# Altium schematic sheet mcu1_secondary.SchDoc: foxBMS BMS-Master
size A3; DocumentNumber: 11; SheetNumber: 11; SheetTotal: 24; Author: Fraunhofer IISB foxBMS Team; REL-DATE: 2017-05-16; VERSION: 1.0.2; SheetDescription: MCU1 (Secondary); ClassName: ISO_MCU_SEC
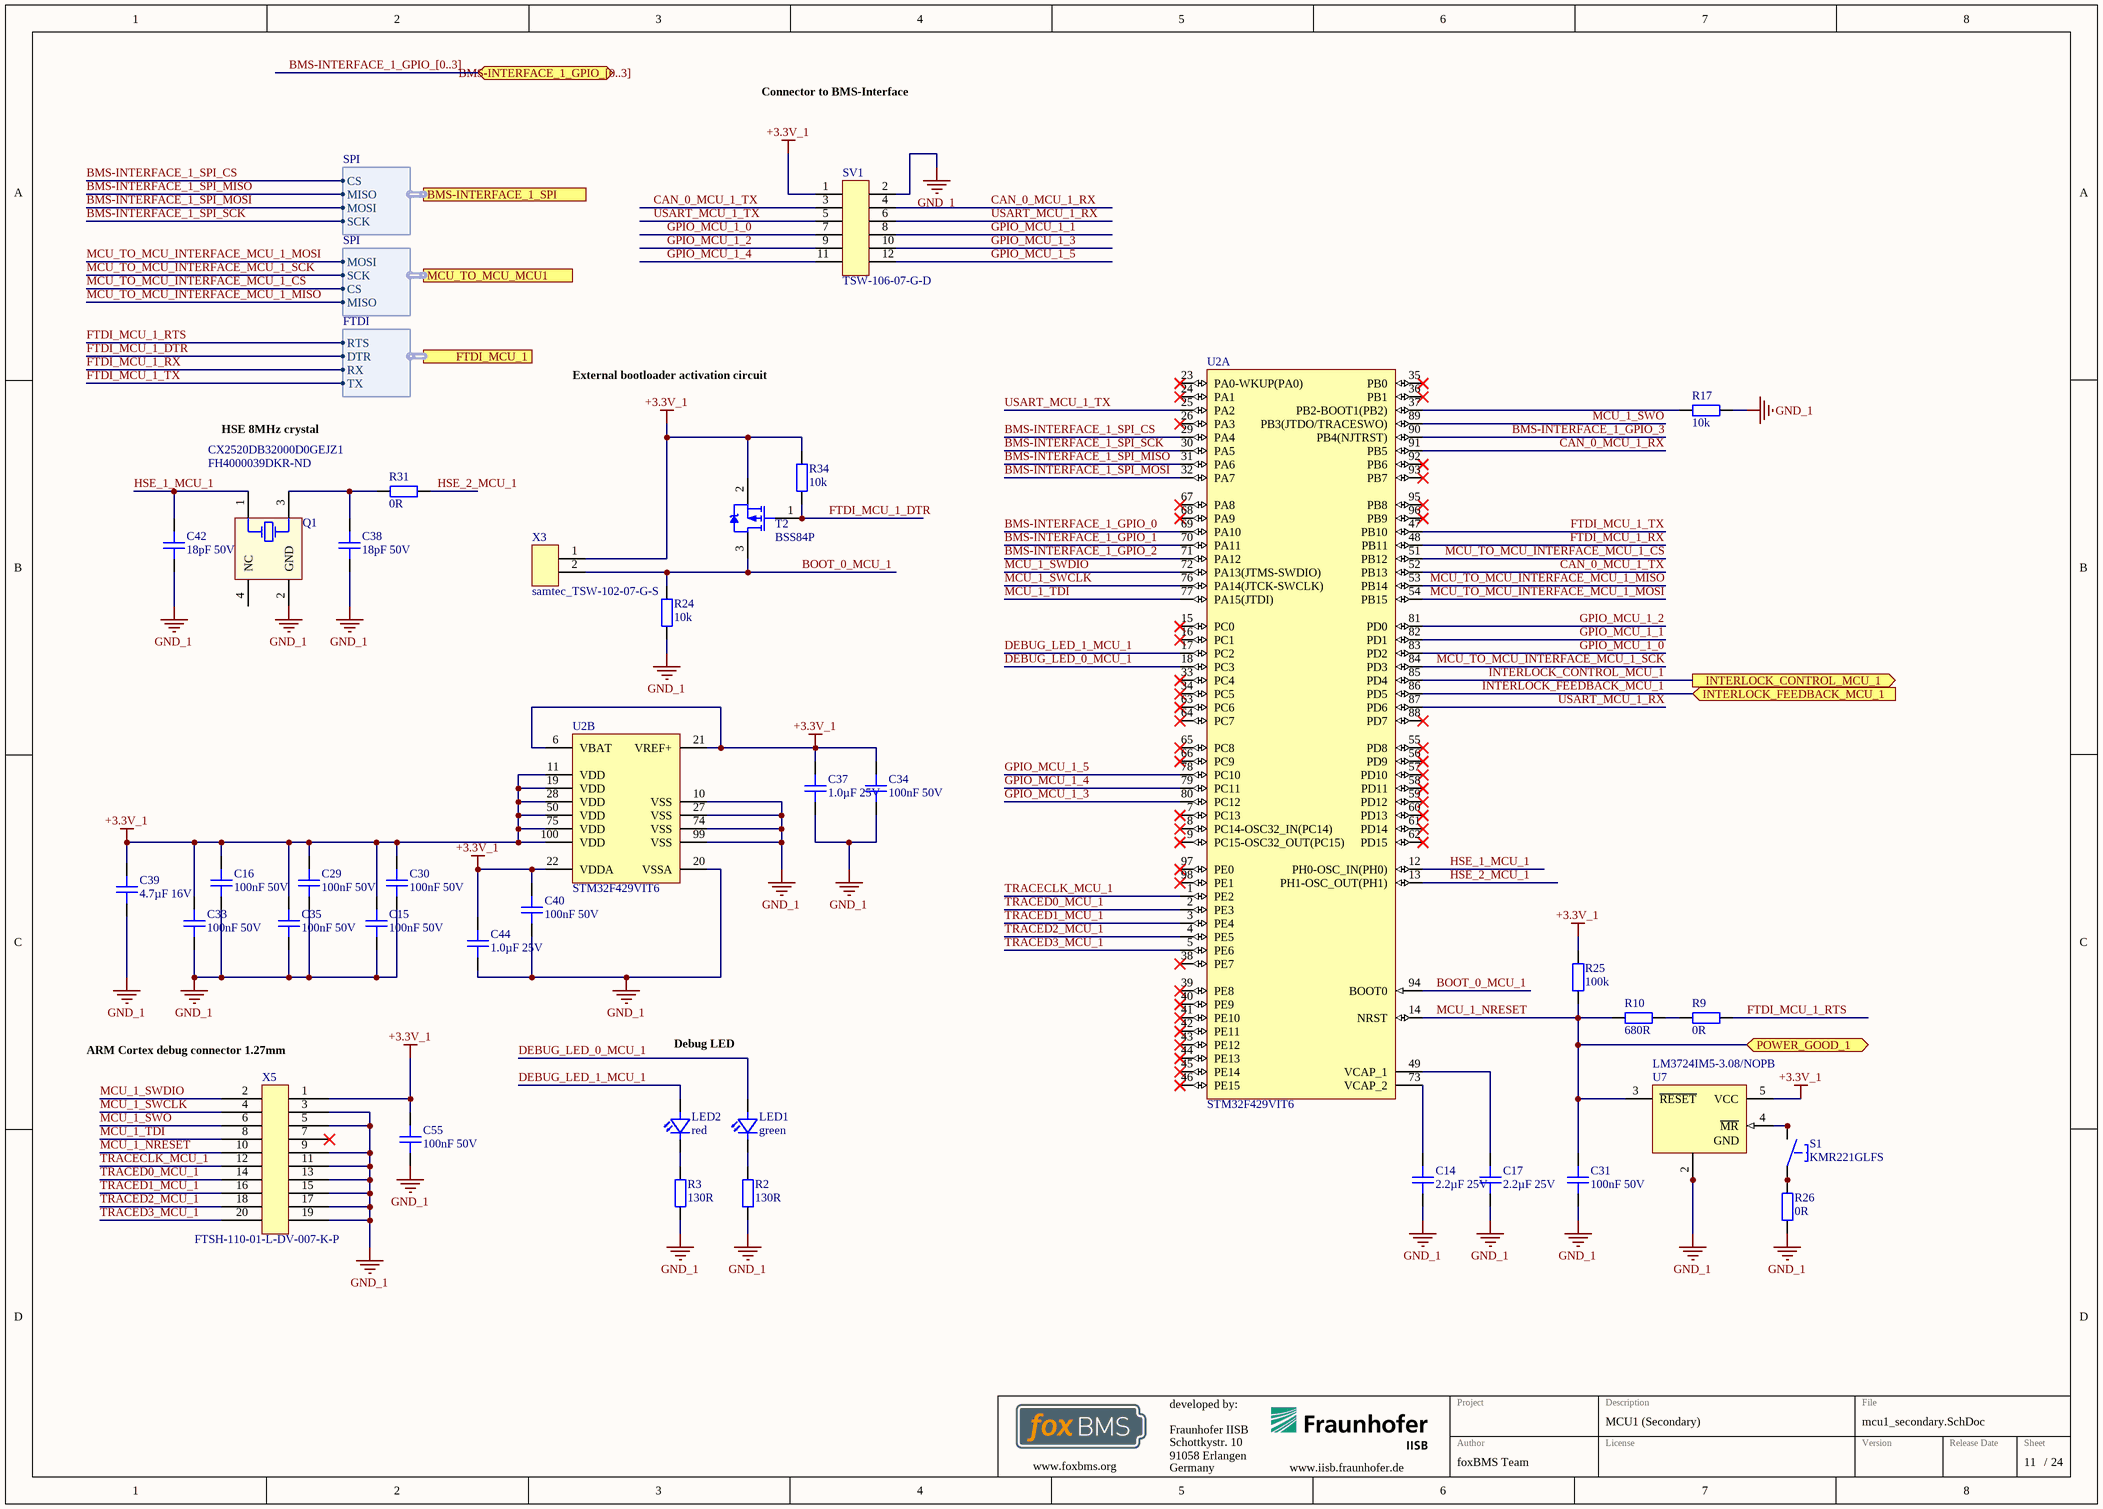
[diagram p0: mcu1_secondary.SchDoc]

## Parts
C14  2.2µF 25V  [0805C]
C15  100nF 50V  [0402C]
C16  100nF 50V  [0402C]
C17  2.2µF 25V  [0805C]
C29  100nF 50V  [0402C]
C30  100nF 50V  [0402C]
C31  100nF 50V  [0603C]
C33  100nF 50V  [0402C]
C34  100nF 50V  [0402C]
C35  100nF 50V  [0402C]
C37  1.0µF 25V  [0603C]
C38  18pF 50V  [0402C]
C39  4.7µF 16V  [0805C]
C40  100nF 50V  [0402C]
C42  18pF 50V  [0402C]
C44  1.0µF 25V  [0603C]
C55  100nF 50V  [0603C]
LED1  green  [LEDC1608X07N]
LED2  red  [LEDC1608X07N]
Q1  CX2520DB32000D0GEJZ1  Supplier Part Number 1: FH4000039DKR-ND  [AVX-CX2520DB32000D0GEJZ1-4_V]
R2  130R  [0603R]
R3  130R  [0603R]
R9  0R  [0603R]
R10  680R  [0603R]
R17  10k  [0603R]
R24  10k  [0603R]
R25  100k  [0603R]
R26  0R  [0603R]
R31  0R  [0402R]
R34  10k  [0603R]
S1  KMR221GLFS  [KMR2_Series]
SV1  TSW-106-07-G-D  [Pinheader_2.54_2x6]
T2  BSS84P  [INF-PG-SOT23_N]
U2  STM32F429VIT6  [STM-LQFP100_N]  (parts A,B of 2)
U7  LM3724IM5-3.08/NOPB  [MF05A_N]
X3  samtec_TSW-102-07-G-S  [Pinheader_2.54_2]
X5  FTSH-110-01-L-DV-007-K-P  [CORTEX_DEBUG_20_PIN]

## Ports
BMS-INTERFACE_1_GPIO_[0..3] (bidir), BMS-INTERFACE_1_SPI (harness SPI), FTDI_MCU_1 (harness FTDI), INTERLOCK_CONTROL_MCU_1 (out), INTERLOCK_FEEDBACK_MCU_1 (in), MCU_TO_MCU_MCU1 (harness SPI), POWER_GOOD_1 (bidir)

## Harnesses
SPI: CS, MISO, MOSI, SCK
FTDI: RTS, DTR, RX, TX

## Nets
+3.3V_1: C15.1 C16.1 C29.1 C30.1 C33.1 C34.1 C35.1 C37.1 C39.1 C40.1 C44.1 C55.1 R25.2 R34.2 SV1.1 T2.2(SOURCE) U2.6(VBAT) U2.11(VDD) U2.19(VDD) U2.21(VREF+) U2.22(VDDA) U2.28(VDD) U2.50(VDD) U2.75(VDD) U2.100(VDD) U7.5(VCC) X3.1 X5.1
GND_1: C14.2 C15.2 C16.2 C17.2 C29.2 C30.2 C31.2 C33.2 C34.2 C35.2 C37.2 C38.2 C39.2 C40.2 C42.1 C44.2 C55.2 Q1.2(GND) R2.1 R3.1 R17.1 R24.1 R26.1 SV1.2 U2.10(VSS) U2.20(VSSA) U2.27(VSS) U2.74(VSS) U2.99(VSS) U7.1(GND) U7.2(GND) X5.3 X5.5 X5.9 X5.11 X5.13 X5.15 X5.17 X5.19
BMS-INTERFACE_1_GPIO_0: U2.69(PA10)
BMS-INTERFACE_1_GPIO_1: U2.70(PA11)
BMS-INTERFACE_1_GPIO_2: U2.71(PA12)
BMS-INTERFACE_1_GPIO_3: U2.90(PB4(NJTRST))
BMS-INTERFACE_1_SPI_CS: U2.29(PA4) ; port BMS-INTERFACE_1_SPI.CS
BMS-INTERFACE_1_SPI_MISO: U2.31(PA6) ; port BMS-INTERFACE_1_SPI.MISO
BMS-INTERFACE_1_SPI_MOSI: U2.32(PA7) ; port BMS-INTERFACE_1_SPI.MOSI
BMS-INTERFACE_1_SPI_SCK: U2.30(PA5) ; port BMS-INTERFACE_1_SPI.SCK
BOOT_0_MCU_1: R24.2 T2.3(DRAIN) U2.94(BOOT0) X3.2
CAN_0_MCU_1_RX: SV1.4 U2.91(PB5)
CAN_0_MCU_1_TX: SV1.3 U2.52(PB13)
DEBUG_LED_0_MCU_1: LED1.2(A) U2.18(PC3)
DEBUG_LED_1_MCU_1: LED2.2(A) U2.17(PC2)
FTDI_MCU_1_DTR: R34.1 T2.1(GATE) ; port FTDI_MCU_1.DTR
FTDI_MCU_1_RTS: R9.2 ; port FTDI_MCU_1.RTS
FTDI_MCU_1_RX: U2.48(PB11) ; port FTDI_MCU_1.RX
FTDI_MCU_1_TX: U2.47(PB10) ; port FTDI_MCU_1.TX
GPIO_MCU_1_0: SV1.7 U2.83(PD2)
GPIO_MCU_1_1: SV1.8 U2.82(PD1)
GPIO_MCU_1_2: SV1.9 U2.81(PD0)
GPIO_MCU_1_3: SV1.10 U2.80(PC12)
GPIO_MCU_1_4: SV1.11 U2.79(PC11)
GPIO_MCU_1_5: SV1.12 U2.78(PC10)
HSE_1_MCU_1: C42.2 Q1.1(HOT) U2.12(PH0-OSC_IN(PH0))
HSE_2_MCU_1: R31.1 U2.13(PH1-OSC_OUT(PH1))
INTERLOCK_CONTROL_MCU_1: U2.85(PD4) ; port INTERLOCK_CONTROL_MCU_1
INTERLOCK_FEEDBACK_MCU_1: U2.86(PD5) ; port INTERLOCK_FEEDBACK_MCU_1
MCU_1_NRESET: C31.1 R10.1 R25.1 U2.14(NRST) U7.3(~{RESET}) X5.10 ; port POWER_GOOD_1
MCU_1_SWCLK: U2.76(PA14(JTCK-SWCLK)) X5.4
MCU_1_SWDIO: U2.72(PA13(JTMS-SWDIO)) X5.2
MCU_1_SWO: U2.89(PB3(JTDO/TRACESWO)) X5.6
MCU_1_TDI: U2.77(PA15(JTDI)) X5.8
MCU_TO_MCU_INTERFACE_MCU_1_CS: U2.51(PB12) ; port MCU_TO_MCU_MCU1.CS
MCU_TO_MCU_INTERFACE_MCU_1_MISO: U2.53(PB14) ; port MCU_TO_MCU_MCU1.MISO
MCU_TO_MCU_INTERFACE_MCU_1_MOSI: U2.54(PB15) ; port MCU_TO_MCU_MCU1.MOSI
MCU_TO_MCU_INTERFACE_MCU_1_SCK: U2.84(PD3) ; port MCU_TO_MCU_MCU1.SCK
TRACECLK_MCU_1: U2.1(PE2) X5.12
TRACED0_MCU_1: U2.2(PE3) X5.14
TRACED1_MCU_1: U2.3(PE4) X5.16
TRACED2_MCU_1: U2.4(PE5) X5.18
TRACED3_MCU_1: U2.5(PE6) X5.20
USART_MCU_1_RX: SV1.6 U2.87(PD6)
USART_MCU_1_TX: SV1.5 U2.25(PA2)
NetC14_1: C14.1 U2.73(VCAP_2)
NetC17_1: C17.1 U2.49(VCAP_1)
NetC38_1: C38.1 Q1.3(HOT) R31.2
NetLED1_1: LED1.1(C) R2.2
NetLED2_1: LED2.1(C) R3.2
NetR9_1: R9.1 R10.2
NetR17_2: R17.2 U2.37(PB2-BOOT1(PB2))
NetR26_2: R26.2 S1.1 S1.2
NetS1_3: S1.3 S1.4 U7.4(~{MR})

Not connected (* = marked no-connect by the designer): Q1 4(NC); U2 7(PC13)* 8(PC14-OSC32_IN(PC14))* 9(PC15-OSC32_OUT(PC15))* 15(PC0)* 16(PC1)* 23(PA0-WKUP(PA0))* 24(PA1)* 26(PA3)* 33(PC4)* 34(PC5)* 35(PB0)* 36(PB1)* 38(PE7)* 39(PE8)* 40(PE9)* 41(PE10)* 42(PE11)* 43(PE12)* 44(PE13)* 45(PE14)* 46(PE15)* 55(PD8)* 56(PD9)* 57(PD10)* 58(PD11)* 59(PD12)* 60(PD13)* 61(PD14)* 62(PD15)* 63(PC6)* 64(PC7)* 65(PC8)* 66(PC9)* 67(PA8)* 68(PA9)* 88(PD7)* 92(PB6)* 93(PB7)* 95(PB8)* 96(PB9)* 97(PE0)* 98(PE1)*; X5 7*

## Buses and harness runs
bus BMS-INTERFACE_1_GPIO_[0..3] = port BMS-INTERFACE_1_GPIO_[0..3]

## Notes on the sheet
- Connector to BMS-Interface
- External bootloader activation circuit
- HSE 8MHz crystal
- (near X5) ARM Cortex debug connector 1.27mm
- Debug LED
- Fraunhofer IISB
- Schottkystr. 10
- developed by:
- 91058 Erlangen
- Germany
- Author
- Project
- License
- Description
- File
- Version
- Release Date
- Sheet
- www.foxbms.org
- www.iisb.fraunhofer.de
- foxBMS Team
- /

## Library data of the parts
C14 C17 = gen_C_ceramic_2u2_50V_X7R_0805: Ceramic, 2.2µF, ±10%, 25V, X7R, –55 to 125°C, 0805 (2012),RoHS, Automotive; Part Number: GCJ21BR71E225KA01; Manufacturer: Murata; Capacitance: 2u2; Case EIA: 0805; Case Metric: 2012; Automotive Qualified: True; PnP Package: C_0805_10; PnP Value: 2.2µF/25V/X7R; Rated Voltage: 25V; Dielectric: X7R; Height - Seated (Max): 1.25mm; Mounting Type: SurfaceMount,MLCC; Operating Temperature: –55 to 125°C; Series: GCJ; Tolerance: ±10%; Manufacturer_Part_Number: GCJ21BR71E225KA01
C15 C16 C29 C30 C33-C35 = gen_C_ceramic_100n_50V_X7R_0402: Ceramic, 100nF, ±10%, 50V, X7R, –55 to 125°C, 0402 (1005),RoHS, Automotive; Part Number: GCM155R71H104KE02; Manufacturer: Murata; Capacitance: 100n; Case EIA: 0402; Case Metric: 1005; PnP Package: C_0402_10; PnP Value: 100nF/50V/X7R; Automotive Qualified: True; PnP equipped: x; Rated Voltage: 50V; Dielectric: X7R; Supplier 1: Digi-Key; Supplier Part Number 1: 490-10672-1-ND; Height - Seated (Max): 0.5mm; Mounting Type: SurfaceMount,MLCC; Operating Temperature: –55 to 125°C; Series: GCM; Tolerance: ±10%; Manufacturer_Part_Number: GCM155R71H104KE02
C31 C55 = gen_C_ceramic_100n_50V_X7R_0603: Ceramic, 100nF, ±10%, 50V, X7R, –55 to 125°C, 0603 (1608),RoHS, Automotive; Part Number: GCJ188R71H104KA12; Manufacturer: Murata; Capacitance: 100n; Case EIA: 0603; Case Metric: 1608; PnP Package: C_0603_10; PnP Value: 100nF/50V/X7R; PnP equipped: x; Automotive Qualified: True; Rated Voltage: 50V; Dielectric: X7R; Supplier 1: Digi-Key; Supplier Part Number 1: 490-5798-1-ND; Height - Seated (Max): 0.8mm; Mounting Type: SurfaceMount,MLCC; Operating Temperature: –55 to 125°C; Series: GCJ; Tolerance: ±10%; Manufacturer_Part_Number: GCJ188R71H104KA12
C37 C44 = gen_C_ceramic_1u_25V_X7R_0603: Ceramic, 1.0µF, ±10%, 25V, X7R, –55 to 125°C, 0603 (1608),RoHS, Automotive; Part Number: GCJ188R71E105KA01; Manufacturer: Murata; Capacitance: 1µF; Case EIA: 0603; Case Metric: 1608; PnP Package: C_0603_10; PnP Value: 1.0µF/25V/X7R; Automotive Qualified: True; Rated Voltage: 25V; Dielectric: X7R; Supplier 1: Digi-Key; Supplier Part Number 1: 490-14409-1-ND; Height - Seated (Max): 0.8mm; Mounting Type: SurfaceMount,MLCC; Operating Temperature: –55 to 125°C; Series: GCJ; Tolerance: ±10%; Manufacturer_Part_Number: GCJ188R71E105KA01
C38 C42 = gen_C_ceramic_18p_50V_C0G_0402: Ceramic, 18pF, ±5%, 50V, X7R, 25 to 125°C, 0402 (1005),RoHS, Automotive; Part Number: GCM1555C1H180JA16#; Manufacturer: Murata; Capacitance: 18p; Dielectric: C0G; Case EIA: 0402; Case Metric: 1005; Automotive Qualified: True; PnP Package: C_0402_10; PnP Value: 18pF/50V/X7R; Rated Voltage: 50V; Supplier 1: Digi-Key; Supplier Part Number 1: 490-12650-1-ND; Height - Seated (Max): 0.5mm; Mounting Type: SurfaceMount,MLCC; Operating Temperature: 25 to 125°C; Series: GCM; Tolerance: ±5%; Manufacturer_Part_Number: GCM1555C1H180JA16#
C39 = gen_C_ceramic_4u7_16V_X7R_0805: Ceramic, 4.7µF, ±10%, 16V, X7R, –55 to 125°C, 0805 (2012),RoHS, Automotive; Part Number: GCJ21BR71C475KA01; Manufacturer: Murata; Capacitance: 4u7; Case EIA: 0805; Case Metric: 2012; AVT Set: x; Automotive Qualified: True; PnP Package: C_0805_10; PnP Value: 4.7µF/16V/X7R; Rated Voltage: 16V; Dielectric: X7R; Supplier 1: Digi-Key; Supplier Part Number 1: 490-10557-1-ND; Height - Seated (Max): 1.25mm; Mounting Type: SurfaceMount,MLCC; Operating Temperature: –55 to 125°C; Series: GCJ; Tolerance: ±10%; Manufacturer_Part_Number: GCJ21BR71C475KA01
C40 = gen_C_ceramic_100n_50V_X7R_0402: Ceramic, 100nF, ±10%, 50V, X7R, –55 to 125°C, 0402 (1005),RoHS, Automotive; Part Number: GCM155R71H104KE02; Manufacturer: Murata; Capacitance: 100n; Case EIA: 0402; Case Metric: 1005; PnP Package: C_0402_10; PnP Value: 100nF/50V/X7R; PnP equipped: x; Automotive Qualified: True; Rated Voltage: 50V; Dielectric: X7R; Supplier 1: Digi-Key; Supplier Part Number 1: 490-10672-1-ND; Height - Seated (Max): 0.5mm; Mounting Type: SurfaceMount,MLCC; Operating Temperature: –55 to 125°C; Series: GCM; Tolerance: ±10%; Manufacturer_Part_Number: GCM155R71H104KE02
LED1 = gen_LED_0603_green: LED; Breakdown Voltage: 5V; Continuous Forward Current: 20mA; Forward Voltage @ 20mA: 2.2V; Automotive Qualified: False; Case EIA: 0603; Case Metric: 1608; Part Number: gen_LED_0603_green; Color: green; PnP Package: LED_0603; Supplier 1: Farnell; Supplier Part Number 1: 2099223
LED2 = gen_LED_0603_red: LED; Breakdown Voltage: 5V; Continuous Forward Current: 20mA; Forward Voltage @ 20mA: 2V; Automotive Qualified: False; Case EIA: 0603; Case Metric: 1608; Part Number: gen_LED_0603_red; Color: red; PnP Package: LED_0603; Supplier 1: Farnell; Supplier Part Number 1: 2099221
Q1 = CMP-0449-00001-1: Crystal,CRYSTAL 40MHZ 15PF 85degC Surface Mount 2.5 x 2.0 mm; Manufacturer: Kyocera; Drive Level: 10uW (100uW max.); Motional Series Resistance: 50 ohm (max); Frequency Range: 32000 kHz; Load Capacitance: 8 pF; Packing: Tape and Reel; ComponentLink2URL: http://global.kyocera.com/prdct/electro/pdf/xtal/cx2520db_cs_e.pdf; ComponentLink1Description: Manufacturer URL; PackageDescription: 4-Pin Hand Drawnï¼ŒBody 2.5x2mm; ComponentLink1URL: http://global.kyocera.com/; ComponentLink3URL: http://global.kyocera.com/prdct/electro/pdf/xtal/cx2520db_cs_e.pdf; ComponentLink2Description: Datasheet; PackageReference: CX2520DB32000D0GEJZ1-4; Operating Temperature: -10 to 70 degC; PartNumber: CX2520DB32000D0GEJZ1; ComponentLink3Description: Package Specification; Mounting Technology: Surface Mount; Supplier 1: Digi-Key
R2 R3 = gen_R_130R_0603: SMD Resistor 130R 0603; Tolerance: 1%; Power: 0.1W; Case EIA: 0603; Case Metric: 1608; Maximum Working Voltage: 75V; PnP Package: R_0603; Automotive Qualified: False; Part Number: gen_R_130R_0603; Operating Temperature: -55°C - +155°C; Resistance: 130R; Series: E24, E96; PnP Value: 130R; Supplier 1: Farnell; Supplier Part Number 1: 2379959
R9 R26 = gen_R_0R_0603: SMD Resistor 0R 0603; Power: 0.1W; Case EIA: 0603; Case Metric: 1608; PnP Package: R_0603; Maximum Working Voltage: 75V; Automotive Qualified: False; Part Number: gen_R_0R_0603; Operating Temperature: -55°C - +155°C; Resistance: 0R; Series: Jumper; PnP Value: 0R; Supplier 1: Farnell; Supplier Part Number 1: 2073345
R10 = gen_R_680R_0603: SMD Resistor 680R 0603; Tolerance: 1%; Power: 0.1W; Case EIA: 0603; Case Metric: 1608; Maximum Working Voltage: 75V; PnP Package: R_0603; Automotive Qualified: False; Part Number: gen_R_680R_0603; Operating Temperature: -55°C - +155°C; Resistance: 680R; Series: E24; PnP Value: 680R; Supplier 1: Farnell; Supplier Part Number 1: 2797303
R17 R24 R34 = gen_R_10k_0603: SMD Resistor 10k 0603; Tolerance: 1%; Power: 0.1W; Case EIA: 0603; Case Metric: 1608; Maximum Working Voltage: 75V; PnP Package: R_0603; Automotive Qualified: False; Part Number: gen_R_10k_0603; Operating Temperature: -55°C - +155°C; Resistance: 10k; Series: E24, E96; PnP Value: 10k; Supplier 1: Farnell; Supplier Part Number 1: 2073349
R25 = gen_R_100k_0603: SMD Resistor 100k 0603; Case EIA: 0603; Case Metric: 1608; PnP Package: R_0603; Automotive Qualified: False; Part Number: gen_R_100k_0603; Operating Temperature: -55°C - +155°C; PnP Value: 100k
R31 = gen_R_0R_0402: SMD Resistor 0R 0402; Case EIA: 0402; Case Metric: 1005; PnP Package: R_0402; Automotive Qualified: False; Part Number: gen_R_0R_0402; PnP Value: 0R; Operating Temperature: -55°C - +155°C
S1 = KMR221GLFS: Microminiature Tactile Switch; Manufacturer: CK Components; Automotive Qualified: False; Part Number: KMR221GLFS; Operating Temperature: -40°C - +85°C; ComponentLink1Description: Datasheet; ComponentLink1URL: http://www.farnell.com/datasheets/1685525.pdf; Supplier 1: Farnell; Supplier Part Number 1: 1201424; Supplier 2: Digikey; Supplier Part Number 2: 401-1426-1-ND; Supplier 3: Mouser; Supplier Part Number 3: 611-KMR211G-LFS
SV1 = samtec_TSW-106-07-G-D: Board-To-Board Connector, Vertical, 2.54 mm, 12 Contacts, Header, TSW Series, Through Hole, 2 Rows; Manufacturer: Samtec; Circuits: 12; Rated Voltage: 500V AC mated with SSW; Automotive Qualified: False; Part Number: TSW-106-07-G-D; Part Name: TSW-106-07-G-D; Operating Temperature: -55°C - +125°C; ComponentLink1Description: Datasheet; ComponentLink1URL: http://www.farnell.com/datasheets/1992055.pdf?_ga=2.196729640.569325269.1503285096-1413671594.1503025027; Supplier 1: Farnell; Supplier Part Number 1: 2025252
T2 = CMP-1099-00028-1: P-Channel SIPMOS Small-Signal-Transistor, -60 V VDS, -0.17 A ID, -55 to 150 degC, PG-SOT23, Reel, Green; Manufacturer: Infineon; VGS(th) (max): -2Â V; VGS(th) (min): -1Â V; VDS (max): -60Â V; Rth: 350Â K/W; Pto t (max): 0.36Â W; ID (max): -0.17Â A; IDpuls (max): -0.68Â A; RDS (on) (max) (@4.5V): 12,000Â mOhm; QG: 1Â nC; Green: TRUE; RDS (on) (max): 8,000Â mOhm; ComponentLink3URL: http://www.infineon.com/dgdl/SOT23-Package_Overview.pdf?folderId=db3a30431936bc4b0119532290053c66&fileId=db3a30431936bc4b0119533468123c85; ComponentLink3Description: Package Specification; Packing: Reel; PartNumber: BSS84P; ComponentLink2Description: Datasheet; Mounting Technology: Surface Mount; ComponentLink2URL: http://www.infineon.com/dgdl/BSS84P_Rev2.7%5B1%5D.pdf?folderId=db3a304314dca38901154a72e3951a65&fileId=db3a304330f68606013118ac7a9b4549; PackageReference: PG-SOT23; ComponentLink1URL: http://www.infineon.com/; PackageVersion: Apr-08; ComponentLink1Description: Manufacturer URL; PackageDescription: 3-Pin Small Outline Transistor Package, 2.9 x 1.3 mm Body, 0.95 mm Pitch; Halogen-free: TRUE; DatasheetVersion: Rev. 2.7; Part Number: BSS84P
U2 = CMP-0243-00030-2: ARM Cortex-M4 32-bit MCU+FPU, 225 DMIPS, 2048 kB Flash, 256 kB Internal RAM, 82 I/Os, 100-pin LQFP, -40 to 85 degC, Tray; Manufacturer: STMicroelectronics; FLASH Size (Prog) (kB): 2048; Supply Voltage(Vcc) min (V): 1.8; Operating Frequency(F) (Processor speed) (MHz): 180; Supply Voltage(Vcc) max (V): 3.6; D/A Converter: 2x12-bit; Internal RAM Size (kB): 256; I/Os (High Current): 82; Mounting Technology: Surface Mount; ComponentLink3URL: http://www.st.com/st-web-ui/static/active/en/resource/technical/document/data_brief/DM00071938.pdf; ComponentLink2URL: http://www.st.com/st-web-ui/static/active/en/resource/technical/document/data_brief/DM00053488.pdf; ComponentLink3Description: Package Specification; Packing: Tray; PackageDescription: 100-Pin Low Profile Quad Flat Package, 14 x 14 mm Body, 0.5 mm Pitch; PartNumber: STM32F429VIT6; ComponentLink2Description: Datasheet; ComponentLink1Description: Manufacturer URL; ComponentLink1URL: http://www.st.com/web/en/home.html; DatasheetVersion: Rev. 2; Core: ARM Cortex-M4; PackageReference: LQFP100; PackageVersion: Rev. 1, 06/2013; Part Number: STM32F429VIT6
U7 = CMP-0063-01088-2: 5-Pin Microprocessor Reset Circuits, 5-pin SOT-23, Pb-Free; Manufacturer: National Semiconductor; PowerWise: N; PackageTopMarking: R53B*XTT; CompType: MiscPower; PackageVersion: revD, Aug-2008; ComponentLink3URL: http://www.national.com/packaging/folders/mf05a.html; ComponentLink2URL: http://www.national.com/pf/LM/LM3724.html; PinCount: 5; ComponentLink2Description: LM3724 Web Page; PackageDescription: Molded SOT-23, .115 x .063 x .040 in Body, 5 Lead, .0375 in Pitch; ComponentLink3Description: MF05A Package Page; ComponentLink1Description: LM3724 Datasheet; RevisionNote: Component URLs added; RoHS: Y; ComponentLink1URL: http://www.national.com/ds/LM/LM3724.pdf; DatasheetVersion: Jul-2007; PackageReference: MF05A
X3 = samtec_TSW-102-07-G-S: Board-To-Board Connector, Vertical, 2.54 mm, 2 Contacts, Header, TSW Series, Through Hole, 1 Row; Manufacturer: Samtec; Circuits: 2; Automotive Qualified: False; Part Number: samtec_TSW-102-07-G-S; Part Name: TSW-102-07-G-S; Operating Temperature: -55°C - +125°C; ComponentLink1Description: Datasheet; ComponentLink1URL: http://www.farnell.com/datasheets/1796313.pdf; Supplier 1: Farnell; Supplier Part Number 1: 2505044
X5 = samtec_FTSH-110-01-L-DV-007-K-P: Board-To-Board Connector, ARM Cortex Debug Header 20 Pin; Manufacturer: Samtec; Circuits: 20; Automotive Qualified: False; Part Number: samtec_FTSH-110-01-L-DV-007-K-P; Part Name: FTSH-110-01-L-DV-007-K-P; Operating Temperature: -55°C - +125°C; Supplier 1: Digikey; Supplier Part Number 1: SAM11268-ND; Supplier 2: Avnet; Supplier Part Number 2: FTSH-110-01-L-DV-007-K-P